# Altium schematic sheet HW_Dron_V2.SchDoc
size A4
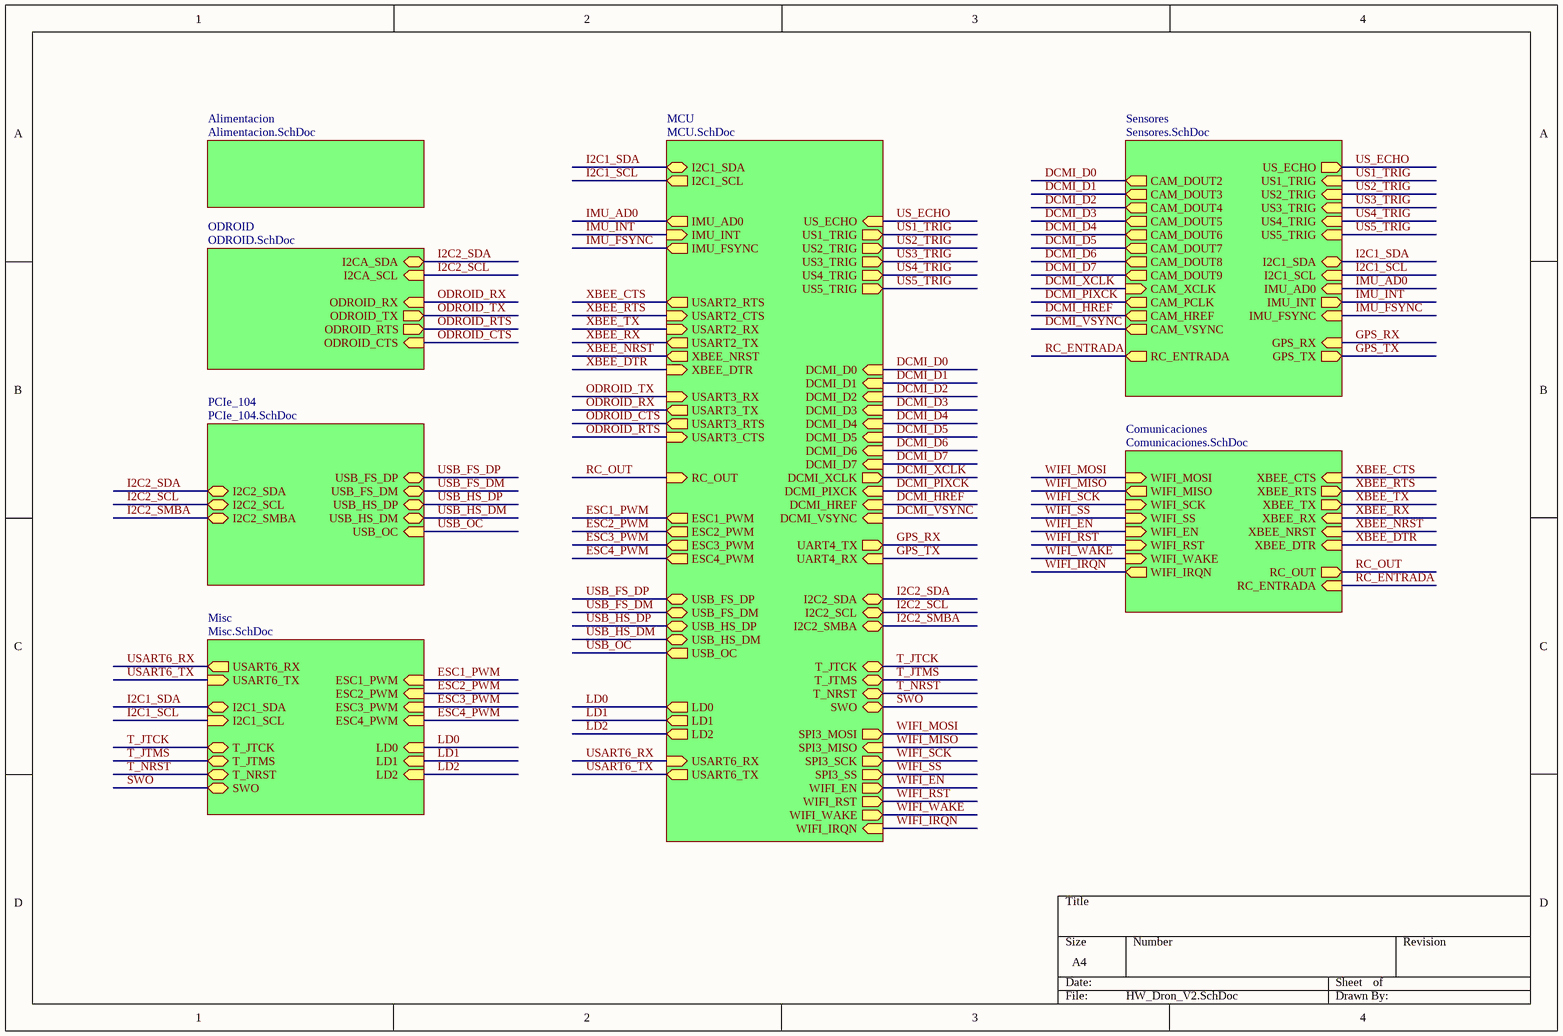
[diagram p0: HW_Dron_V2.SchDoc]

## Sub-sheets
Alimentacion = Alimentacion.SchDoc: no entries
Comunicaciones = Comunicaciones.SchDoc: XBEE_TX (out), XBEE_RX (in), XBEE_NRST (in), XBEE_CTS (in), XBEE_RTS (out), RC_OUT (out), WIFI_MOSI (in), WIFI_MISO (out), WIFI_SCK (in), WIFI_SS (in), WIFI_EN (in), WIFI_RST (in), WIFI_WAKE (in), WIFI_IRQN (out), XBEE_DTR (in), RC_ENTRADA (in)
MCU = MCU.SchDoc: I2C1_SDA (bidir), I2C1_SCL (out), IMU_AD0 (out), IMU_INT (in), US_ECHO (in), US1_TRIG (out), US2_TRIG (out), US3_TRIG (out), US4_TRIG (out), US5_TRIG (out), DCMI_D0 (in), DCMI_D1 (in), DCMI_D2 (in), DCMI_D3 (in), DCMI_D4 (in), DCMI_D5 (in), DCMI_D6 (in), DCMI_D7 (in), DCMI_PIXCK (in), DCMI_HREF (in), DCMI_VSYNC (in), DCMI_XCLK (out), USART2_RX (in), USART2_TX (out), XBEE_NRST (out), USART2_RTS (out), USART2_CTS (in), RC_OUT (in), UART4_TX (out), UART4_RX (in), ESC1_PWM (out), ESC2_PWM (out), ESC3_PWM (out), ESC4_PWM (out), I2C2_SDA (bidir), I2C2_SCL (bidir), I2C2_SMBA (bidir), USB_HS_DP (bidir), USB_HS_DM (bidir), USB_OC (out), T_JTCK, T_JTMS, T_NRST, LD0 (out), LD1 (out), LD2 (out), SPI3_MOSI (out), SPI3_MISO (in), SPI3_SCK (out), SPI3_SS (out), WIFI_EN (out), WIFI_RST (out), WIFI_WAKE (out), WIFI_IRQN (in), USB_FS_DP (bidir), USB_FS_DM (bidir), USART6_RX (in), USART6_TX (out), IMU_FSYNC (out), XBEE_DTR (in), USART3_TX (out), USART3_RX (in), USART3_CTS (in), USART3_RTS (out), SWO
Misc = Misc.SchDoc: ESC1_PWM (in), ESC2_PWM (in), ESC3_PWM (in), ESC4_PWM (in), USART6_RX (out), USART6_TX (in), I2C1_SDA (bidir), I2C1_SCL (in), LD0 (in), LD1 (in), LD2 (in), T_JTCK, T_JTMS, T_NRST, SWO
ODROID = ODROID.SchDoc: ODROID_RX (in), ODROID_TX (out), ODROID_RTS (out), ODROID_CTS (in), I2CA_SDA (bidir), I2CA_SCL (in)
PCIe_104 = PCIe_104.SchDoc: USB_HS_DP (bidir), USB_HS_DM (bidir), USB_OC (in), USB_FS_DP (bidir), USB_FS_DM (bidir), I2C2_SDA (bidir), I2C2_SCL (bidir), I2C2_SMBA (bidir)
Sensores = Sensores.SchDoc: I2C1_SCL (in), I2C1_SDA (bidir), IMU_AD0 (in), IMU_INT (out), US_ECHO (out), US1_TRIG (in), US2_TRIG (in), US3_TRIG (in), US4_TRIG (in), US5_TRIG (in), GPS_RX (in), GPS_TX (out), CAM_PCLK (out), CAM_HREF (out), CAM_VSYNC (out), CAM_XCLK (in), CAM_DOUT2 (out), CAM_DOUT3 (out), CAM_DOUT4 (out), CAM_DOUT5 (out), CAM_DOUT6 (out), CAM_DOUT7 (out), CAM_DOUT8 (out), CAM_DOUT9 (out), IMU_FSYNC (in), RC_ENTRADA (out)

## Nets
DCMI_D0: sheet MCU/DCMI_D0, sheet Sensores/CAM_DOUT2
DCMI_D1: sheet MCU/DCMI_D1, sheet Sensores/CAM_DOUT3
DCMI_D2: sheet MCU/DCMI_D2, sheet Sensores/CAM_DOUT4
DCMI_D3: sheet MCU/DCMI_D3, sheet Sensores/CAM_DOUT5
DCMI_D4: sheet MCU/DCMI_D4, sheet Sensores/CAM_DOUT6
DCMI_D5: sheet MCU/DCMI_D5, sheet Sensores/CAM_DOUT7
DCMI_D6: sheet MCU/DCMI_D6, sheet Sensores/CAM_DOUT8
DCMI_D7: sheet MCU/DCMI_D7, sheet Sensores/CAM_DOUT9
DCMI_HREF: sheet MCU/DCMI_HREF, sheet Sensores/CAM_HREF
DCMI_PIXCK: sheet MCU/DCMI_PIXCK, sheet Sensores/CAM_PCLK
DCMI_VSYNC: sheet MCU/DCMI_VSYNC, sheet Sensores/CAM_VSYNC
DCMI_XCLK: sheet MCU/DCMI_XCLK, sheet Sensores/CAM_XCLK
ESC1_PWM: sheet MCU/ESC1_PWM, sheet Misc/ESC1_PWM
ESC2_PWM: sheet MCU/ESC2_PWM, sheet Misc/ESC2_PWM
ESC3_PWM: sheet MCU/ESC3_PWM, sheet Misc/ESC3_PWM
ESC4_PWM: sheet MCU/ESC4_PWM, sheet Misc/ESC4_PWM
GPS_RX: sheet MCU/UART4_TX, sheet Sensores/GPS_RX
GPS_TX: sheet MCU/UART4_RX, sheet Sensores/GPS_TX
I2C1_SCL: sheet MCU/I2C1_SCL, sheet Sensores/I2C1_SCL, sheet Misc/I2C1_SCL
I2C1_SDA: sheet MCU/I2C1_SDA, sheet Sensores/I2C1_SDA, sheet Misc/I2C1_SDA
I2C2_SCL: sheet MCU/I2C2_SCL, sheet ODROID/I2CA_SCL, sheet PCIe_104/I2C2_SCL
I2C2_SDA: sheet MCU/I2C2_SDA, sheet ODROID/I2CA_SDA, sheet PCIe_104/I2C2_SDA
I2C2_SMBA: sheet MCU/I2C2_SMBA, sheet PCIe_104/I2C2_SMBA
IMU_AD0: sheet MCU/IMU_AD0, sheet Sensores/IMU_AD0
IMU_FSYNC: sheet MCU/IMU_FSYNC, sheet Sensores/IMU_FSYNC
IMU_INT: sheet MCU/IMU_INT, sheet Sensores/IMU_INT
LD0: sheet MCU/LD0, sheet Misc/LD0
LD1: sheet MCU/LD1, sheet Misc/LD1
LD2: sheet MCU/LD2, sheet Misc/LD2
ODROID_CTS: sheet MCU/USART3_RTS, sheet ODROID/ODROID_CTS
ODROID_RTS: sheet MCU/USART3_CTS, sheet ODROID/ODROID_RTS
ODROID_RX: sheet MCU/USART3_TX, sheet ODROID/ODROID_RX
ODROID_TX: sheet MCU/USART3_RX, sheet ODROID/ODROID_TX
RC_ENTRADA: sheet Sensores/RC_ENTRADA, sheet Comunicaciones/RC_ENTRADA
RC_OUT: sheet MCU/RC_OUT, sheet Comunicaciones/RC_OUT
SWO: sheet MCU/SWO, sheet Misc/SWO
T_JTCK: sheet MCU/T_JTCK, sheet Misc/T_JTCK
T_JTMS: sheet MCU/T_JTMS, sheet Misc/T_JTMS
T_NRST: sheet MCU/T_NRST, sheet Misc/T_NRST
US1_TRIG: sheet MCU/US1_TRIG, sheet Sensores/US1_TRIG
US2_TRIG: sheet MCU/US2_TRIG, sheet Sensores/US2_TRIG
US3_TRIG: sheet MCU/US3_TRIG, sheet Sensores/US3_TRIG
US4_TRIG: sheet MCU/US4_TRIG, sheet Sensores/US4_TRIG
US5_TRIG: sheet MCU/US5_TRIG, sheet Sensores/US5_TRIG
US_ECHO: sheet MCU/US_ECHO, sheet Sensores/US_ECHO
USART6_RX: sheet MCU/USART6_RX, sheet Misc/USART6_RX
USART6_TX: sheet MCU/USART6_TX, sheet Misc/USART6_TX
USB_FS_DM: sheet MCU/USB_FS_DM, sheet PCIe_104/USB_FS_DM
USB_FS_DP: sheet MCU/USB_FS_DP, sheet PCIe_104/USB_FS_DP
USB_HS_DM: sheet MCU/USB_HS_DM, sheet PCIe_104/USB_HS_DM
USB_HS_DP: sheet MCU/USB_HS_DP, sheet PCIe_104/USB_HS_DP
USB_OC: sheet MCU/USB_OC, sheet PCIe_104/USB_OC
WIFI_EN: sheet MCU/WIFI_EN, sheet Comunicaciones/WIFI_EN
WIFI_IRQN: sheet MCU/WIFI_IRQN, sheet Comunicaciones/WIFI_IRQN
WIFI_MISO: sheet MCU/SPI3_MISO, sheet Comunicaciones/WIFI_MISO
WIFI_MOSI: sheet MCU/SPI3_MOSI, sheet Comunicaciones/WIFI_MOSI
WIFI_RST: sheet MCU/WIFI_RST, sheet Comunicaciones/WIFI_RST
WIFI_SCK: sheet MCU/SPI3_SCK, sheet Comunicaciones/WIFI_SCK
WIFI_SS: sheet MCU/SPI3_SS, sheet Comunicaciones/WIFI_SS
WIFI_WAKE: sheet MCU/WIFI_WAKE, sheet Comunicaciones/WIFI_WAKE
XBEE_CTS: sheet MCU/USART2_RTS, sheet Comunicaciones/XBEE_CTS
XBEE_DTR: sheet MCU/XBEE_DTR, sheet Comunicaciones/XBEE_DTR
XBEE_NRST: sheet MCU/XBEE_NRST, sheet Comunicaciones/XBEE_NRST
XBEE_RTS: sheet MCU/USART2_CTS, sheet Comunicaciones/XBEE_RTS
XBEE_RX: sheet MCU/USART2_TX, sheet Comunicaciones/XBEE_RX
XBEE_TX: sheet MCU/USART2_RX, sheet Comunicaciones/XBEE_TX